# Altium schematic sheet 19C_3G_LTE_MODEM.SchDoc
size 420 x 297 mm
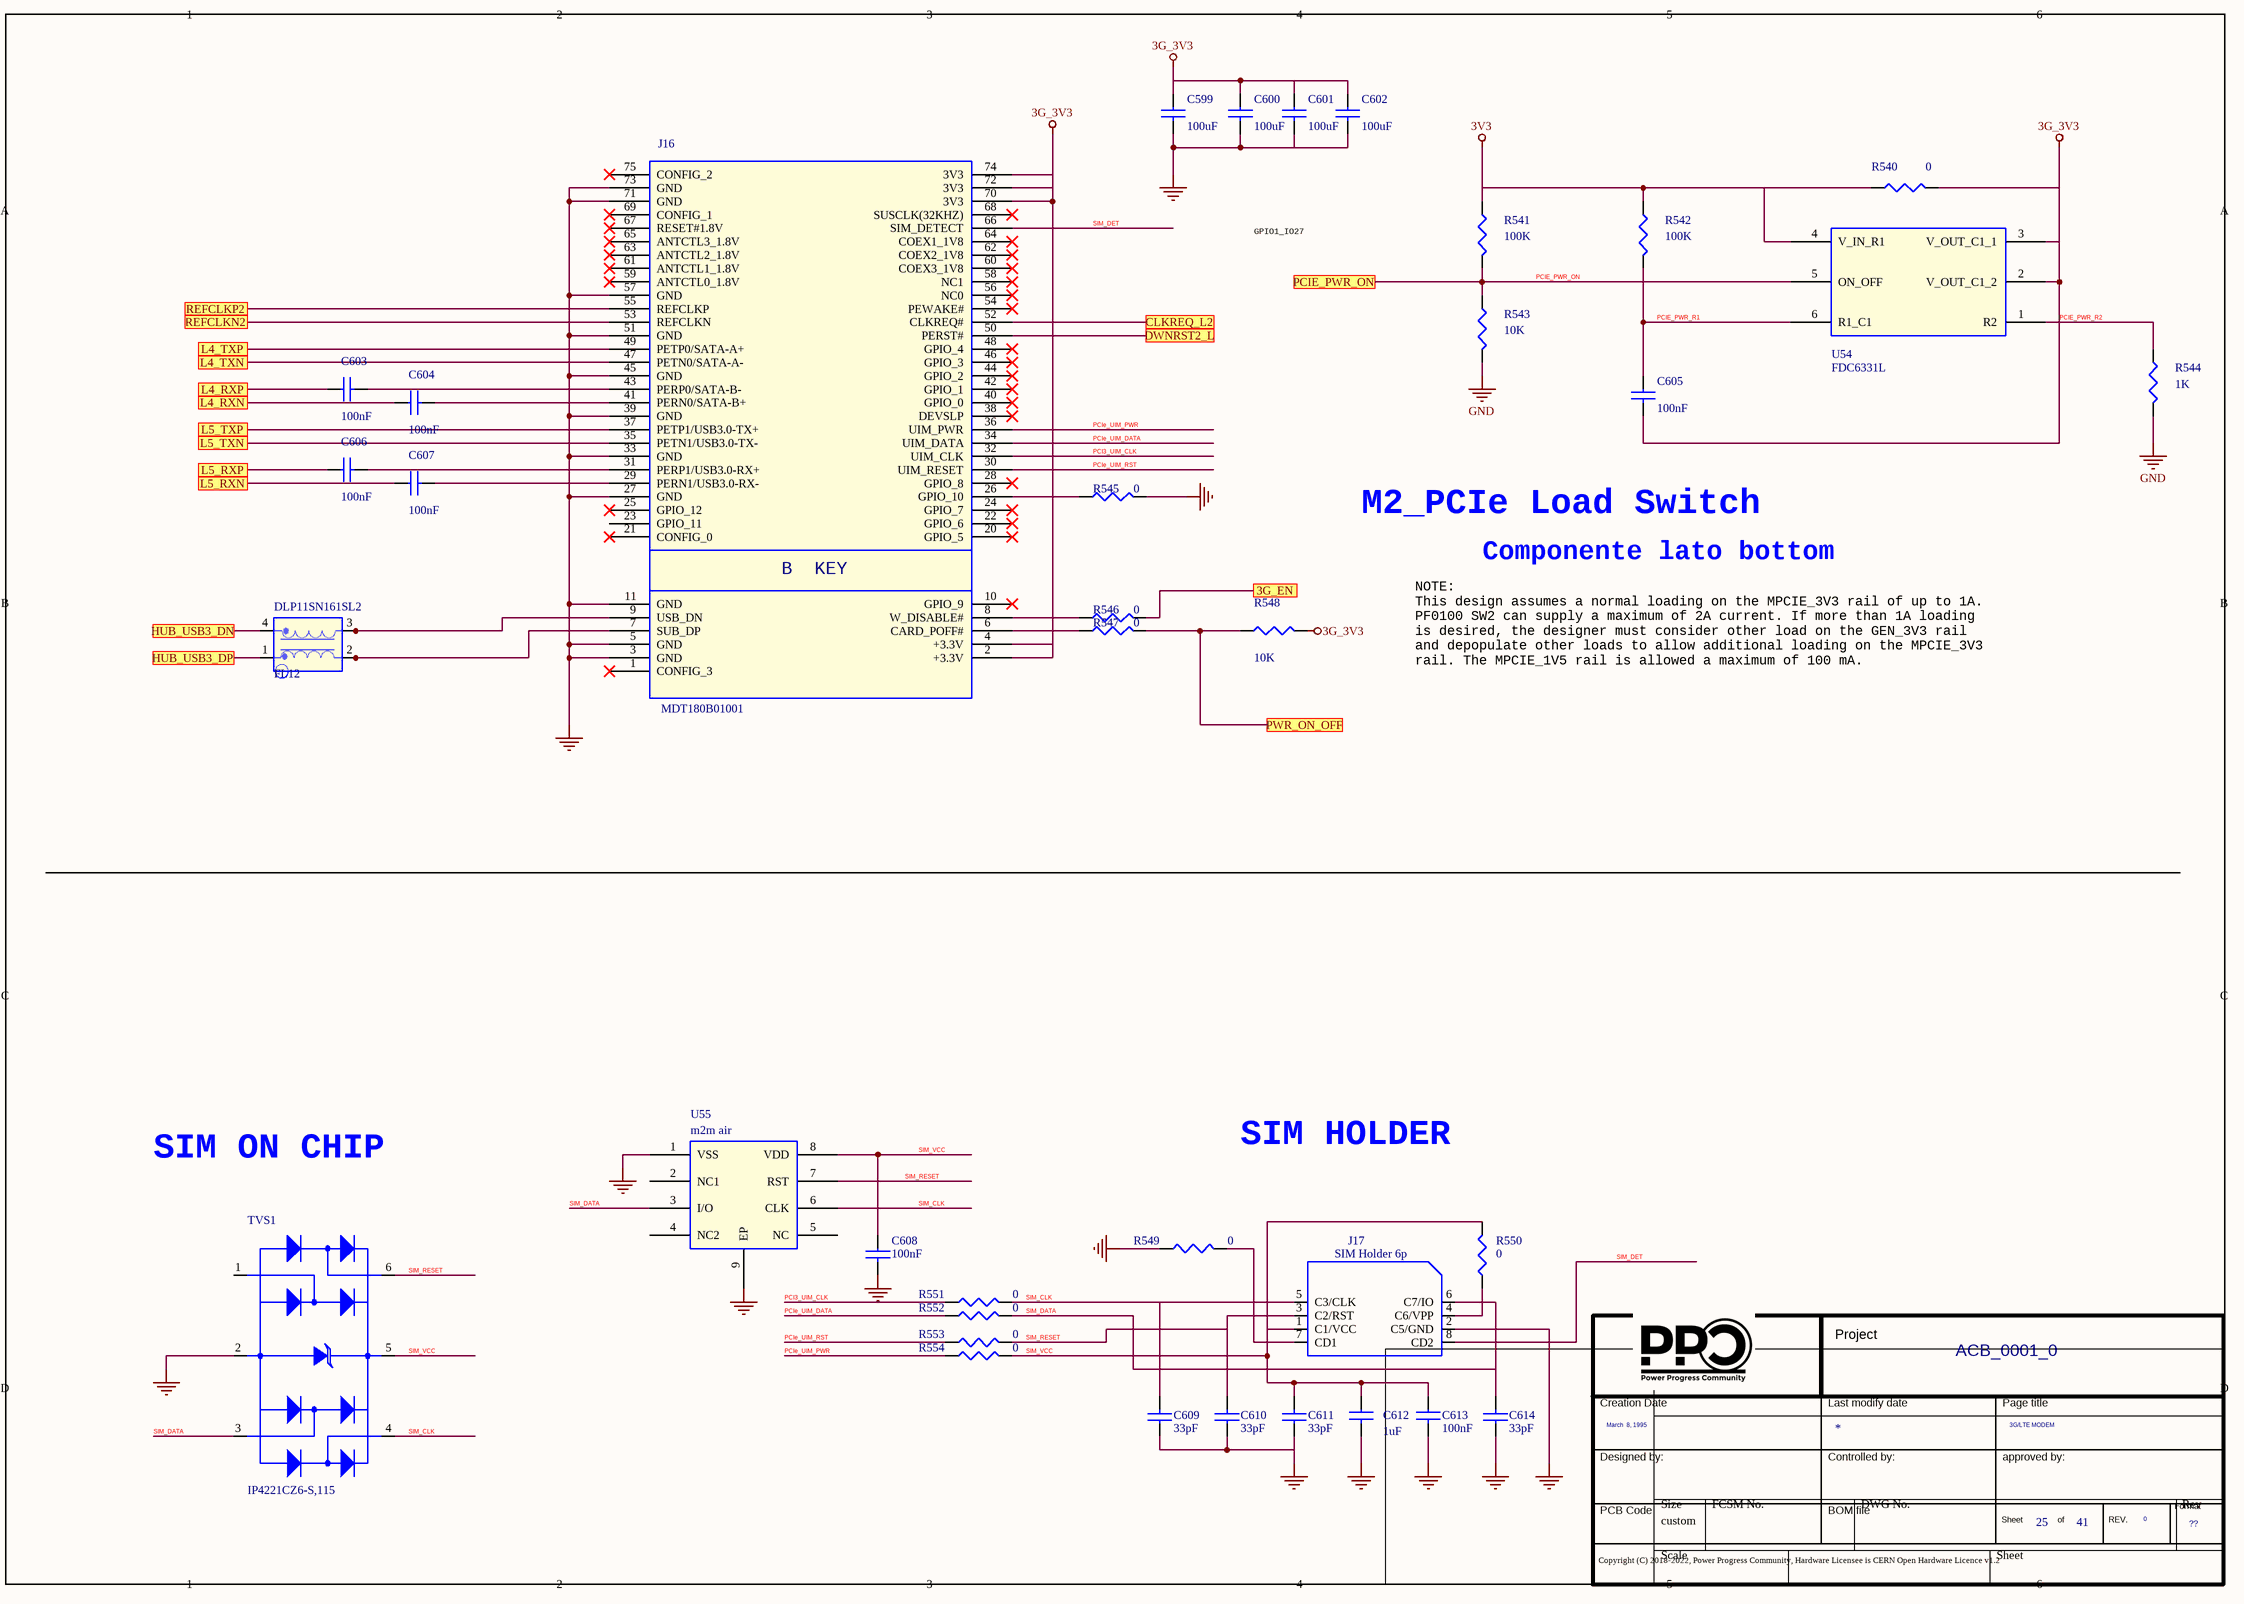
[diagram p0: 19C_3G_LTE_MODEM.SchDoc]

## Parts
*  Page Count: 41  Page Create Date: March  8, 1995  Page Number: 25  Page Size: ??  Page Title: 3G/LTE MODEM  RevCode: 0  Title: ACB_0001_0  (hidden comment: Title_block_PPC)  (graphical)
C599  100uF  [SMD_1210]
C600  100uF  [SMD_1210]
C601  100uF  [SMD_1210]
C602  100uF  [SMD_1210]
C603  100nF  [SMD_0402]
C604  100nF  [SMD_0402]
C605  100nF  [SMD_0402]
C606  100nF  [SMD_0402]
C607  100nF  [SMD_0402]
C608  100nF  [SMD_0402]
C609  33pF  [SMD_0402]
C610  33pF  [SMD_0402]
C611  33pF  [SMD_0402]
C612  1uF  [SMD_0402]
C613  100nF  [SMD_0402]
C614  33pF  [SMD_0402]
FL12  DLP11SN161SL2  [SMD]
J16  MDT180B01001  [67 PIN PASSO 0.5mm]
J17  SIM Holder 6p  [SMD 6 PIN]
R540  0  [SMD_1206]
R541  100K  [SMD_0402]
R542  100K  [SMD_0402]
R543  10K  [SMD_0402]
R544  1K  [SMD_0402]
R545  0  [SMD_0402]
R546  0  [SMD_0402]
R547  0  [SMD_0402]
R548  10K  [SMD_0402]
R549  0  [SMD_0402]
R550  0  [SMD_0402]
R551  0  [SMD_0402]
R552  0  [SMD_0402]
R553  0  [SMD_0402]
R554  0  [SMD_0402]
TVS1  IP4221CZ6-S,115  [	XSON-6]
U54  FDC6331L  [SOT_6]
U55  m2m air  [SO-8]

## Ports
3G_EN, CLKREQ_L2, DWNRST2_L, HUB_USB3_DN, HUB_USB3_DP, L4_RXN, L4_RXP, L4_TXN, L4_TXP, L5_RXN, L5_RXP, L5_TXN, L5_TXP, PCIE_PWR_ON, PWR_ON_OFF, REFCLKN2, REFCLKP2

## Nets
3V3: R540.1 R541.1 R542.1 U54.4(V_IN_R1)
GND: C599.2 C600.2 C601.2 C602.2 C608.2 C609.1 C610.1 C611.1 C612.2 C613.2 C614.1 J16.3(GND) J16.5(GND) J16.11(GND) J16.27(GND) J16.33(GND) J16.39(GND) J16.45(GND) J16.51(GND) J16.57(GND) J16.71(GND) J16.73(GND) J17.2(C5/GND) R543.2 R544.2 R545.2 R549.1 TVS1.2(GND) U55.1(VSS) U55.9(EP)
PCIE_PWR_R2: C599.1 C600.1 C601.1 C602.1 C605.2 J16.2(+3.3V) J16.4(+3.3V) J16.70(3V3) J16.72(3V3) J16.74(3V3) R540.2 R544.1 R548.2 U54.1(R2) U54.2(V_OUT_C1_2) U54.3(V_OUT_C1_1)  [also labelled 3G_3V3]
3G_EN: R546.2 ; port 3G_EN
CLKREQ_L2: J16.52(CLKREQ#) ; port CLKREQ_L2
DWNRST2_L: J16.50(PERST#) ; port DWNRST2_L
HUB_USB3_DN: FL12.4 ; port HUB_USB3_DN
HUB_USB3_DP: FL12.1 ; port HUB_USB3_DP
L4_RXN: C604.1 ; port L4_RXN
L4_RXP: C603.1 ; port L4_RXP
L4_TXN: J16.47(PETN0/SATA-A-) ; port L4_TXN
L4_TXP: J16.49(PETP0/SATA-A+) ; port L4_TXP
L5_RXN: C607.1 ; port L5_RXN
L5_RXP: C606.1 ; port L5_RXP
L5_TXN: J16.35(PETN1/USB3.0-TX-) ; port L5_TXN
L5_TXP: J16.37(PETP1/USB3.0-TX+) ; port L5_TXP
PCI3_UIM_CLK: J16.32(UIM_CLK) R551.1
PCIE_PWR_ON: R541.2 R543.1 U54.5(ON_OFF) ; port PCIE_PWR_ON
PCIE_PWR_R1: C605.1 R542.2 U54.6(R1_C1)
PCIe_UIM_DATA: J16.34(UIM_DATA) R552.1
PCIe_UIM_PWR: J16.36(UIM_PWR) R554.1
PCIe_UIM_RST: J16.30(UIM_RESET) R553.1
PWR_ON_OFF: R547.2 R548.1 ; port PWR_ON_OFF
REFCLKN2: J16.53(REFCLKN) ; port REFCLKN2
REFCLKP2: J16.55(REFCLKP) ; port REFCLKP2
SIM_CLK: C609.2 J17.5(C3/CLK) R551.2 TVS1.4(IO3) U55.6(CLK)
SIM_DATA: C614.2 J17.6(C7/IO) R552.2 TVS1.3(IO2) U55.3(I/O)
SIM_DET: J16.66(SIM_DETECT) J17.8(CD2)
SIM_RESET: C610.2 J17.3(C2/RST) R553.2 TVS1.6(IO4) U55.7(RST)
SIM_VCC: C608.1 C611.2 C612.1 C613.1 J17.1(C1/VCC) R550.2 R554.2 TVS1.5(VCC) U55.8(VDD)
NetC603_2: C603.2 J16.43(PERP0/SATA-B-)
NetC604_2: C604.2 J16.41(PERN0/SATA-B+)
NetC606_2: C606.2 J16.31(PERP1/USB3.0-RX+)
NetC607_2: C607.2 J16.29(PERN1/USB3.0-RX-)
NetFL12_2: FL12.2 J16.7(SUB_DP)
NetFL12_3: FL12.3 J16.9(USB_DN)
NetJ16_6: J16.6(CARD_POFF#) R547.1
NetJ16_8: J16.8(W_DISABLE#) R546.1
NetJ16_26: J16.26(GPIO_10) R545.1
NetJ17_4: J17.4(C6/VPP) R550.1
NetJ17_7: J17.7(CD1) R549.2

Not connected (* = marked no-connect by the designer): J16 1(CONFIG_3)* 10(GPIO_9)* 20(GPIO_5)* 21(CONFIG_0)* 22(GPIO_6)* 23(GPIO_11) 24(GPIO_7)* 25(GPIO_12)* 28(GPIO_8)* 38(DEVSLP)* 40(GPIO_0)* 42(GPIO_1)* 44(GPIO_2)* 46(GPIO_3)* 48(GPIO_4)* 54(PEWAKE#)* 56(NC0)* 58(NC1)* 59(ANTCTL0_1.8V)* 60(COEX3_1V8)* 61(ANTCTL1_1.8V)* 62(COEX2_1V8)* 63(ANTCTL2_1.8V)* 64(COEX1_1V8)* 65(ANTCTL3_1.8V)* 67(RESET#1.8V)* 68(SUSCLK(32KHZ))* 69(CONFIG_1)* 75(CONFIG_2)*; TVS1 1(IO1); U55 2(NC1) 4(NC2) 5(NC)

## Notes on the sheet
- GPIO1_IO27
- M2_PCIe Load Switch
- NOTE:
  This design assumes a normal loading on the MPCIE_3V3 rail of up to 1A.
  PF0100 SW2 can supply a maximum of 2A current. If more than 1A loading
  is desired, the designer must consider other load on the GEN_3V3 rail
  and depopulate other loads to allow additional loading on the MPCIE_3V3
  rail. The MPCIE_1V5 rail is allowed a maximum of 100 mA.
- Componente lato bottom
- SIM ON CHIP
- SIM HOLDER
- (in symbol M2_B_KEY) B  KEY
- (in symbol Title_block_PPC) Project; Creation Date; Last modify date; Page title; Designed by:; Controlled by:; approved by:; Format; PCB Code; BOM file; Sheet; of; REV.; Copyright (C) 2018-2022, Power Progress Community, Hardware Licensee is CERN Open Hardware Licence v1.2

## Library data of the parts
C599-C602 = CAP NP_Dup3: COND.CER.100uF 6,3V 1210 X5R 20% SMD; Part Number: PASSIVE_265; Manufacturer 1: Murata; Manufacturer Part Number 1: GRM32ER60J107ME20L; RSM: RC1210; PCB Footprint: SMD_1210; Part Type: Capacitors\Ceramic\SMD\1210; Distributor 1: MURATA ELETTRONICA SPA
C603 C604 C606 C607 = CAP NP_Dup3: COND.CER. 100NF 50V 0402 X7R SMD; Manufacturer Part Number 1: CGA2B3X7R1H104M050BD; Manufacturer 1: TDK; Part Number: PASSIVE_24; RSM: RC0402; PCB Footprint: SMD_0402; Part Type: Capacitors\Ceramic\SMD\0402
C605 = CAP NP_Dup6: COND.CER. 100NF 50V 0402 X7R SMD; Manufacturer Part Number 1: CGA2B3X7R1H104M050BD; Manufacturer 1: TDK; Part Number: PASSIVE_24; RSM: RC0402; TECNO77: C0402; PCB Footprint: SMD_0402; Distributor 1: MURATA ELETTRONICA SPA; Part Type: Capacitors\Ceramic\SMD\0402
C608 = CAP NP_Dup5: COND.CER. 100NF 50V 0402 X7R SMD; Part Number: PASSIVE_24; Manufacturer 1: TDK; Manufacturer Part Number 1: CGA2B3X7R1H104M050BD; LNK_PART: C0402X55; RSM: RC0402; TECNO77: C0402; PCB Footprint: SMD_0402; Part Type: Capacitors\Ceramic\SMD\0402; Distributor 1: MURATA ELETTRONICA SPA
C609-C611 = CAP NP_Dup5: COND.CER. 33PF 50V 0402 5% COG SMD; Manufacturer Part Number 1: GRM1555C1H330JZ01D_; Manufacturer 1: Murata; Part Number: PASSIVE_76; TECNO77: C0402; RSM: RC0402; PCB Footprint: SMD_0402; Distributor 1: MURATA ELETTRONICA SPA; Part Type: Capacitors\Ceramic\SMD\0402
C612 = CAP NP_Dup3: CAP CER 1UF 25V X6S 0402; Manufacturer Part Number 1: GRM155C81E105KE11D; Manufacturer 1: Murata; Part Number: PASSIVE_1446; RSM: RC0402; PCB Footprint: SMD_0402; Part Type: Capacitors\Ceramic\SMD\0402
C613 = CAP NP_Dup5: COND.CER. 100NF 50V 0402 X7R SMD; Part Number: PASSIVE_24; Manufacturer 1: TDK; Manufacturer Part Number 1: CGA2B3X7R1H104M050BD; RSM: RC0402; TECNO77: C0402; PCB Footprint: SMD_0402; Part Type: Capacitors\Ceramic\SMD\0402; Distributor 1: DIGKEY (445-9694-2-ND)
C614 = CAP NP_Dup5: COND.CER. 33PF 50V 0402 5% COG SMD; Part Number: PASSIVE_76; Manufacturer 1: Murata; Manufacturer Part Number 1: GRM1555C1H330JZ01D_; TECNO77: C0402; RSM: RC0402; PCB Footprint: SMD_0402; Part Type: Capacitors\Ceramic\SMD\0402; Distributor 1: MURATA ELETTRONICA SPA
FL12 = USB_CHOKE: CHOKE COMMON MODE 90 OHM 0805; Manufacturer Part Number 1: DLW21HN900SQ2L; Manufacturer 1: Murata; Part Number: PASSIVE_1366; RSM: EMI-DLW21; PCB Footprint: SMD; Distributor 1: DIGIKEY(490-1064-1-ND); Part Type: FILTER
J16 = M2_B_KEY: Connettori PCI Express/PCI 67P SMT RCPT H1.8 B Key; Manufacturer 1: AMPHENOL; Part Number: CONNECTORS_681; RSM: FCI-MDT180M01001; PCB Footprint: 67 PIN PASSO 0.5mm; Distributor 1: MOUSER(523-MDT180B01001); Manufacturer Part Number 1: MDT180B01001; Part Type: CON_M2
J17 = SIMHOLD_6_PIN_AVX_OK: CONNECTOR SIM CARD W/OUT BOSS; Part Number: CONNECTORS_333; Manufacturer 1: AVX; Manufacturer Part Number 1: 045036006211862+; TECNO77: CN-SIM-KYOCERA-5036006; RSM: AVX-SIM-045036006211862; PCB Footprint: SMD 6 PIN; Part Type: SOCKET\SIM_HOLDER; Distributor 1: Mouser(581-045036006211862+)
R540 = R_Dup8: RESIS. 0R 1/4W 1206 SMD E96; Part Number: PASSIVE_1266; Manufacturer 1: YAGEO; Manufacturer Part Number 1: RC1206JR-070RL; TECNO77: R1206; RSM: RC1206; PCB Footprint: SMD_1206; Part Type: Resistors\Fixed\SMD\1206\5%; Distributor 1: TTI ITALY SRL
R541 R542 = R_Dup6: RESIS.CHIP 100K 5% 0402 SMD; Manufacturer 1: ROYAL OHM; Part Number: PASSIVE_813; RSM: RC0402; Manufacturer Part Number 1: RESIS.CHIP 100K 5% 0402 SMD; PCB Footprint: SMD_0402; Part Type: Resistors\Fixed\SMD\0402\5%
R543 R548 = R_Dup6: RESIS.CHIP 10K 1% 0402 SMD; Manufacturer 1: ROYAL OHM; Part Number: PASSIVE_584; RSM: RC0402; Manufacturer Part Number 1: RESIS.CHIP 10K 1% 0402 SMD; PCB Footprint: SMD_0402; Part Type: Resistors\Fixed\SMD\0402\1%
R544 = R_Dup6: RESIS.CHIP 1K 1% 0402 SMD; Manufacturer 1: ROYAL OHM; Part Number: PASSIVE_628; RSM: RC0402; Manufacturer Part Number 1: RESIS.CHIP 1K 1% 0402 SMD; PCB Footprint: SMD_0402; Part Type: Resistors\Fixed\SMD\0402\1%
R545-R547 = R_Dup9: RESIS.CHIP 0R 5% 0402 SMD; Part Number: PASSIVE_805; Manufacturer 1: ROYAL OHM; RSM: RC0402; PCB Footprint: SMD_0402; Part Type: Resistors\Fixed\SMD\0402\5%; Manufacturer Part Number 1: RESIS.CHIP 0R 5% 0402 SMD; Distributor 1: CAMEL ELETTRONICA SRL  #
R549 R554 = R_Dup7: RESIS.CHIP 0R 5% 0402 SMD; Manufacturer 1: ROYAL OHM; Part Number: PASSIVE_805; TECNO77: R0402; RSM: RC0402; PCB Footprint: SMD_0402; Distributor 1: CAMEL ELETTRONICA SRL  #; Manufacturer Part Number 1: RESIS.CHIP 0R 5% 0402 SMD; Part Type: Resistors\Fixed\SMD\0402\5%
R550 = R_Dup5: RESIS.CHIP 0R 5% 0402 SMD; Part Number: PASSIVE_805; Manufacturer 1: ROYAL OHM; TECNO77: R0402; RSM: RC0402; PCB Footprint: SMD_0402; Part Type: Resistors\Fixed\SMD\0402\5%; Manufacturer Part Number 1: RESIS.CHIP 0R 5% 0402 SMD; Distributor 1: CAMEL ELETTRONICA SRL  #
R551-R553 = R_Dup7: RESIS.CHIP 0R 5% 0402 SMD; Part Number: PASSIVE_805; Manufacturer 1: ROYAL OHM; TECNO77: R0402; RSM: RC0402; PCB Footprint: SMD_0402; Part Type: Resistors\Fixed\SMD\0402\5%; Manufacturer Part Number 1: RESIS.CHIP 0R 5% 0402 SMD; Distributor 1: CAMEL ELETTRONICA SRL  #
TVS1 = TVS_ETHERNET: TVS ESD Dual INTEG ESD Protection SPI; Manufacturer 1: NXP; Part Number: DISCRETE_218; PCB Footprint: XSON-6; TECNO77: DFN6-1X1.45-P0.5; RSM: SOT-886; Distributor 1: MOUSER(771-IP4221CZ6-S,115 ); Manufacturer Part Number 1: IP4221CZ6-S,115; Part Type: Protections
U54 = FDC6331L: LOAD SWITCH INT 8VIN SSOT-6; Part Number: LINEAR_78; CLASS: IC; TECNO77: SOT23-6; PRIORITY_PN: 051-FDC6331L; AGILE_PN: 315-78829; MFG_NAME01: FAIRCHILD; CAD_APPROVED: Yes; RSM: SSOT6-P-0_95; PCB Footprint: SOT_6; Part Type: PowerSW; Manufacturer Part Number 1: FDC6331L; MFG_PN01: FDC6331L; ROHS: Yes; HEIGHT: 1.1MM; Manufacturer 1: FAIRCHILD; Distributor 1: DIGIKEY (FDC6331LCT-ND)
U55 = MIM_0: MIM m2m air Telit; Part Number: MEMORIES_60; RSM: VQFN-8-5X6; PCB Footprint: VQFN-8; Part Type: MIM; Manufacturer 1: Telit
* = Title_block_PPC: Page Modify Date: *